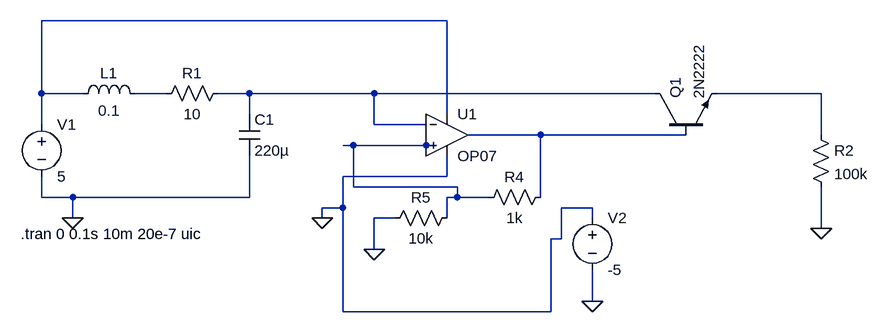
[diagram p0: schematic Draft1h.asc]
Draft1h.asc, the LTspice schematic file:
Version 4.1
SHEET 1 1184 680
WIRE 528 -32 -96 -32
WIRE -96 80 -96 -32
WIRE -32 80 -96 80
WIRE 96 80 48 80
WIRE 224 80 176 80
WIRE 416 80 224 80
WIRE 848 80 416 80
WIRE 1104 80 944 80
WIRE 224 112 224 80
WIRE 528 112 528 -32
WIRE -96 128 -96 80
WIRE 416 128 416 80
WIRE 496 128 416 128
WIRE 672 144 560 144
WIRE 896 144 672 144
WIRE 1104 144 1104 80
WIRE 384 160 368 160
WIRE 496 160 384 160
WIRE 496 176 496 160
WIRE 528 208 528 176
WIRE 528 208 368 208
WIRE 384 224 384 160
WIRE 544 224 384 224
WIRE -96 240 -96 208
WIRE -48 240 -96 240
WIRE 224 240 224 176
WIRE 224 240 -48 240
WIRE 544 240 544 224
WIRE 544 240 528 240
WIRE 592 240 544 240
WIRE 672 240 672 144
WIRE 368 256 368 208
WIRE 368 256 336 256
WIRE 752 256 704 256
WIRE -48 272 -48 240
WIRE 336 272 336 256
WIRE 448 272 416 272
WIRE 528 272 528 240
WIRE 752 272 752 256
WIRE 1104 288 1104 224
WIRE 704 304 704 256
WIRE 704 304 688 304
WIRE 416 320 416 272
WIRE 752 400 752 352
WIRE 368 416 368 256
WIRE 688 416 688 304
WIRE 688 416 368 416
FLAG -48 272 0
FLAG 1104 288 0
FLAG 416 320 0
FLAG 752 400 0
FLAG 336 272 0
SYMBOL cap 208 112 R0
SYMATTR InstName C1
SYMATTR Value 220µ
SYMBOL ind -48 96 R270
WINDOW 0 32 56 VTop 2
WINDOW 3 5 56 VBottom 2
SYMATTR InstName L1
SYMATTR Value 0.1
SYMBOL res 192 64 R90
WINDOW 0 0 56 VBottom 2
WINDOW 3 32 56 VTop 2
SYMATTR InstName R1
SYMATTR Value 10
SYMBOL voltage -96 112 R0
WINDOW 123 0 0 Left 0
WINDOW 39 0 0 Left 0
SYMATTR InstName V1
SYMATTR Value 5
SYMBOL npn 848 144 R270
SYMATTR InstName Q1
SYMATTR Value 2N2222
SYMBOL OpAmps\\OP07 528 80 R0
SYMATTR InstName U1
SYMBOL res 1088 128 R0
SYMATTR InstName R2
SYMATTR Value 100k
SYMBOL res 688 224 R90
WINDOW 0 0 56 VBottom 2
WINDOW 3 32 56 VTop 2
SYMATTR InstName R4
SYMATTR Value 1k
SYMBOL res 544 256 R90
WINDOW 0 0 56 VBottom 2
WINDOW 3 32 56 VTop 2
SYMATTR InstName R5
SYMATTR Value 10k
SYMBOL voltage 752 256 R0
WINDOW 123 0 0 Left 0
WINDOW 39 0 0 Left 0
SYMATTR InstName V2
SYMATTR Value -5
TEXT -128 296 Left 2 !.tran 0 0.1s 10m 20e-7 uic

The netlist it stands for:
* Draft1h.asc
C1 N003 0 220µ
L1 N001 N002 0.1
R1 N003 N002 10
V1 N001 0 5
Q1 N003 N005 N004 0 2N2222
X§U1 N006 N003 N001 0 N005 LT1001  ; OP07, pins In+ In- V+ V- OUT
R2 N004 0 100k
R4 N005 N006 1k
R5 N006 0 10k
V2 0 0 -5
.model NPN NPN
.model PNP PNP
.lib standard.bjt
.tran 0 0.1s 10m 20e-7 uic
.lib LTC.lib
.backanno
.end